# EAGLE schematic Smoothiepanel (EAGLE 6.3)
Assembly variants: NOSCREEN
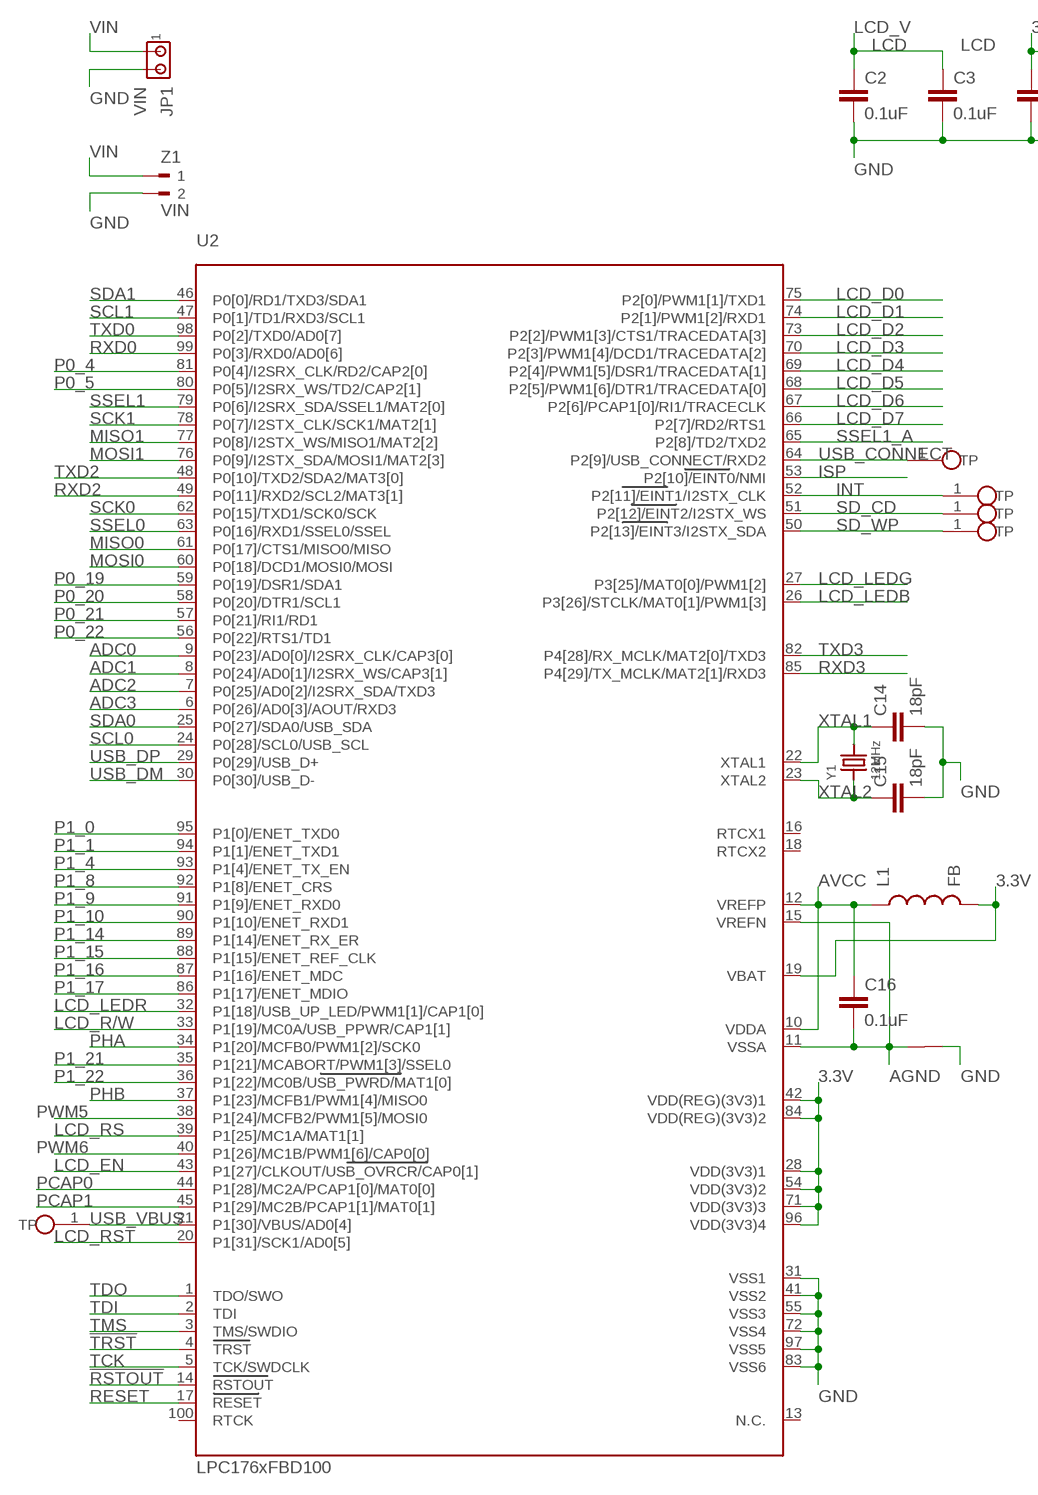
[diagram p0: schematic, sheet 1, part 1 of 2]
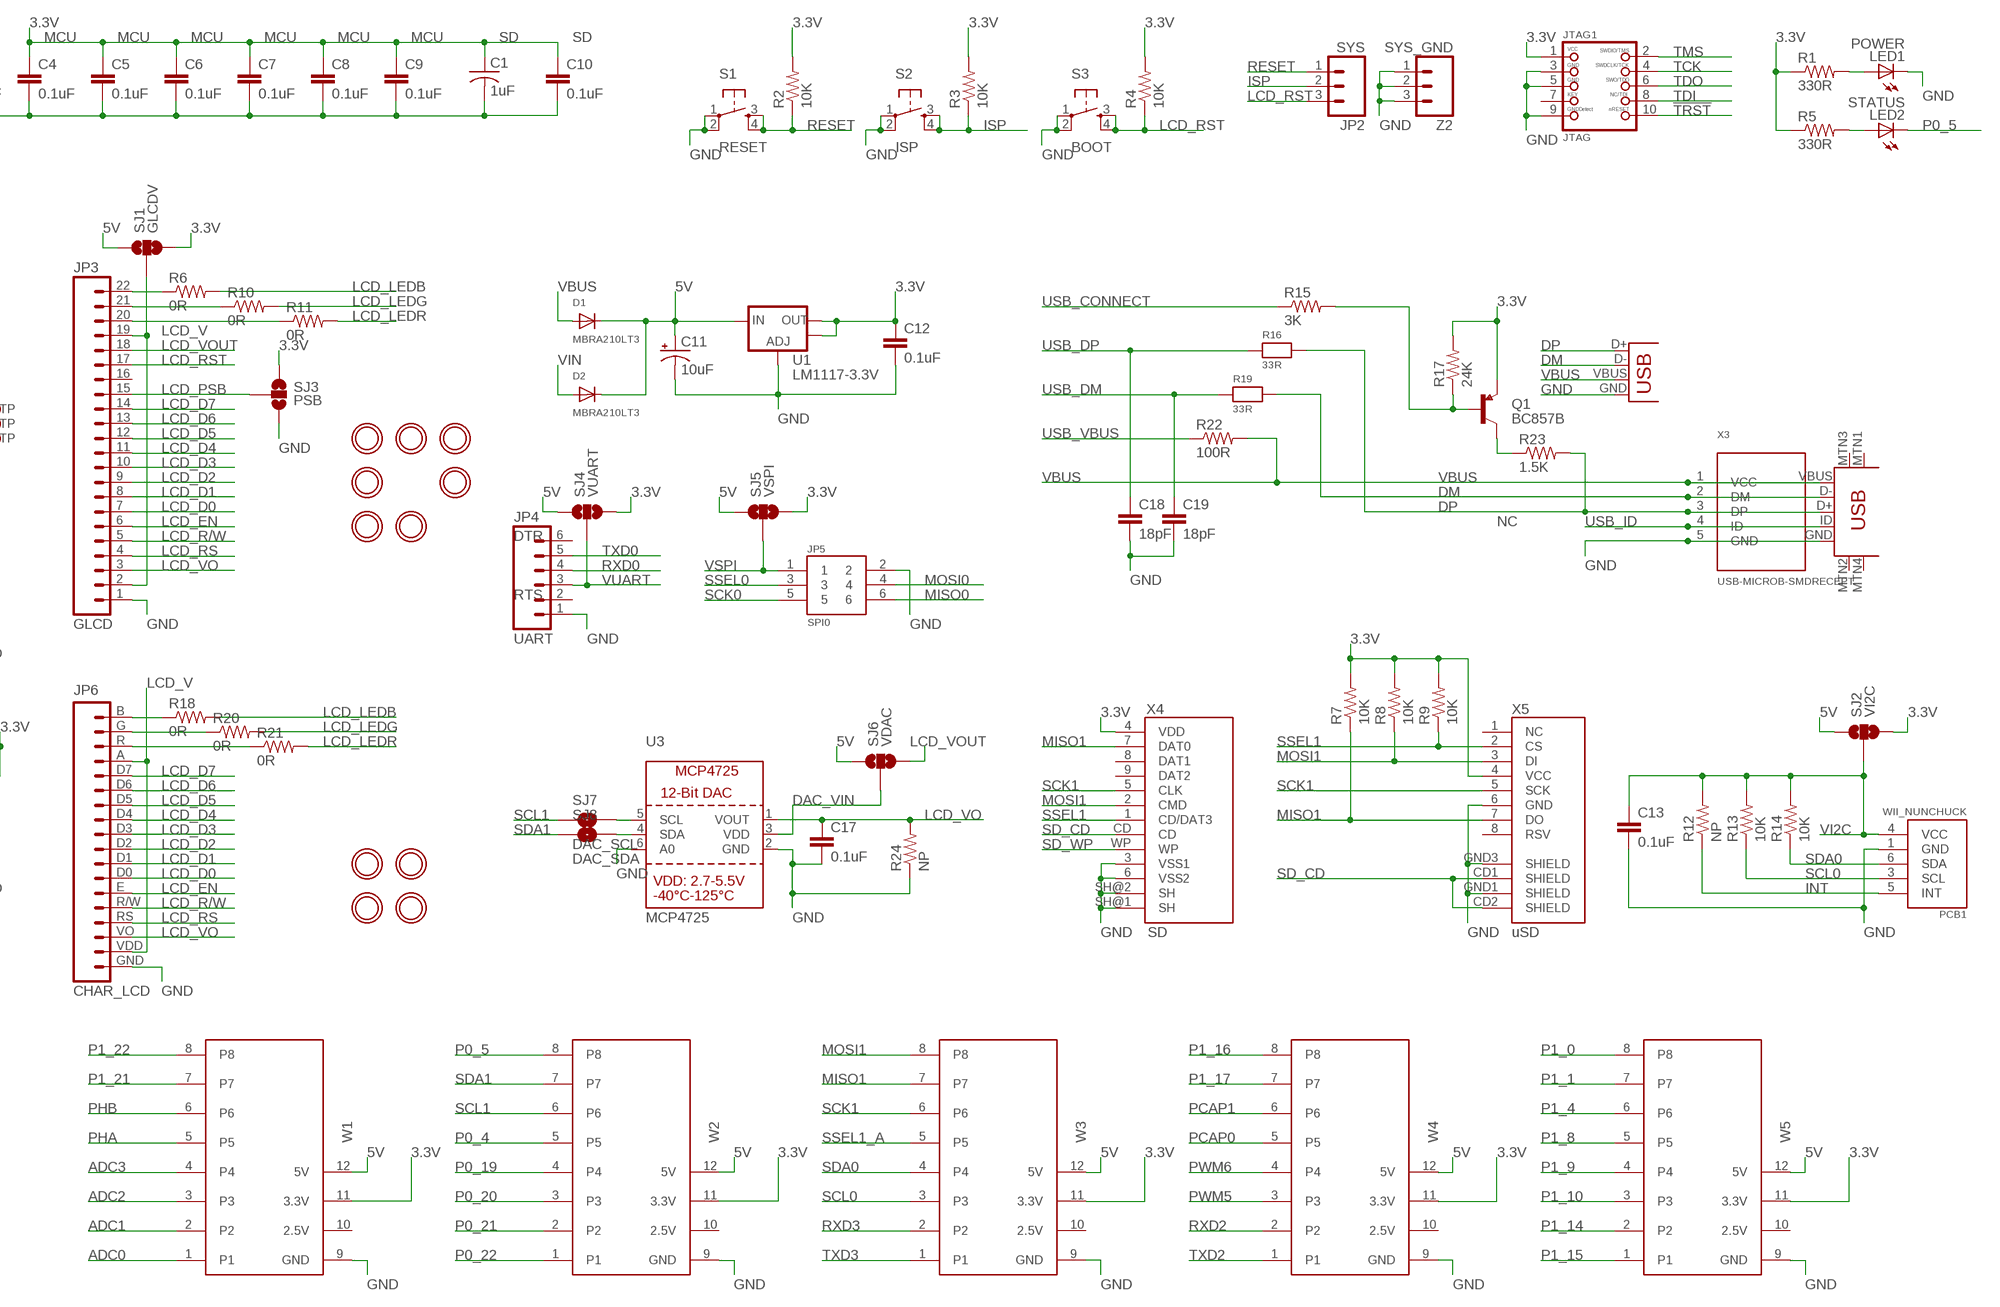
[diagram p1: schematic, sheet 1, part 2 of 2]

## Parts
C1  1uF  C-USC0805  [C0805]
C2  0.1uF  CAP0603-CAP  [0603-CAP]
C3  0.1uF  CAP0603-CAP  [0603-CAP]
C4  0.1uF  CAP0603-CAP  [0603-CAP]
C5  0.1uF  CAP0603-CAP  [0603-CAP]
C6  0.1uF  CAP0603-CAP  [0603-CAP]
C7  0.1uF  CAP0603-CAP  [0603-CAP]
C8  0.1uF  CAP0603-CAP  [0603-CAP]
C9  0.1uF  CAP0603-CAP  [0603-CAP]
C10  0.1uF  CAP0603-CAP  [0603-CAP]
C11  10uF  CAP_POL1206  [EIA3216]
C12  0.1uF  CAP0603-CAP  [0603-CAP]
C13  0.1uF  CAP0603-CAP  [0603-CAP]
C14  18pF  CAP0603-CAP  [0603-CAP]
C15  18pF  CAP0603-CAP  [0603-CAP]
C16  0.1uF  CAP0603-CAP  [0603-CAP]
C17  0.1uF  CAP0603-CAP  [0603-CAP]
C18  18pF  CAP0603-CAP  [0603-CAP]
C19  18pF  CAP0603-CAP  [0603-CAP]
D1  MBRA210LT3  DIODESMA  [SMADIODE]
D2  MBRA210LT3  DIODESMA  [SMADIODE]
JP1  VIN  MTA02-100  [10X02MTA]
JP2  SYS  M03PTH  [1X03]
JP3  GLCD  M22  [1X22]
JP4  UART  M06SIP  [1X06]
JP5  SPI0  M03X2  [2X3-SHROUDED]
JP6  CHAR_LCD  LCD_TEXT  [TEXT_LCD]
JTAG1  JTAG  JTAG-CORTEXM3  [2X05_1.27MM_SMT]
L1  FB  INDUCTOR0603  [0603]
LED1  POWER  LED0603  [LED-0603]
LED2  STATUS  LED0603  [LED-0603]
MH1  MOUNTINGHOLE2.5_THICK  [MOUNTINGHOLE_2.5_PLATED_THICK]
MH2  MOUNTINGHOLE2.5_THICK  [MOUNTINGHOLE_2.5_PLATED_THICK]
MH3  MOUNTINGHOLE2.5_THICK  [MOUNTINGHOLE_2.5_PLATED_THICK]
MH4  MOUNTINGHOLE2.5_THICK  [MOUNTINGHOLE_2.5_PLATED_THICK]
MH5  MOUNTINGHOLE2.5_THICK  [MOUNTINGHOLE_2.5_PLATED_THICK]
MH6  MOUNTINGHOLE2.5_THICK  [MOUNTINGHOLE_2.5_PLATED_THICK]
MH7  MOUNTINGHOLE2.5_THICK  [MOUNTINGHOLE_2.5_PLATED_THICK]
MH8  MOUNTINGHOLE3.0THIN  [MOUNTINGHOLE_3.0_PLATEDTHIN]
MH9  MOUNTINGHOLE3.0THIN  [MOUNTINGHOLE_3.0_PLATEDTHIN]
MH10  MOUNTINGHOLE3.0THIN  [MOUNTINGHOLE_3.0_PLATEDTHIN]
MH11  MOUNTINGHOLE3.0THIN  [MOUNTINGHOLE_3.0_PLATEDTHIN]
N1  NET_LINK  [NET_LINK]
PCB1  WII_NUNCHUCK  [WII_NUNCHUCK]
Q1  BC857B  TRANSISTOR_PNPSMD  [SOT23-3]
R1  330R  RESISTOR0603-RES  [0603-RES]
R2  10K  RESISTOR0603-RES  [0603-RES]
R3  10K  RESISTOR0603-RES  [0603-RES]
R4  10K  RESISTOR0603-RES  [0603-RES]
R5  330R  RESISTOR0603-RES  [0603-RES]
R6  0R  RESISTOR0603-RES  [0603-RES]
R7  10K  RESISTOR0603-RES  [0603-RES]
R8  10K  RESISTOR0603-RES  [0603-RES]
R9  10K  RESISTOR0603-RES  [0603-RES]
R10  0R  RESISTOR0603-RES  [0603-RES]
R11  0R  RESISTOR0603-RES  [0603-RES]
R12  NP  RESISTOR0603-RES  [0603-RES]
R13  10K  RESISTOR0603-RES  [0603-RES]
R14  10K  RESISTOR0603-RES  [0603-RES]
R15  3K  RESISTOR0603-RES  [0603-RES]
R16  33R  RESISTOR_0603MP  [_0603MP]
R17  24K  RESISTOR0603-RES  [0603-RES]
R18  0R  RESISTOR0603-RES  [0603-RES]
R19  33R  RESISTOR_0603MP  [_0603MP]
R20  0R  RESISTOR0603-RES  [0603-RES]
R21  0R  RESISTOR0603-RES  [0603-RES]
R22  100R  RESISTOR0603-RES  [0603-RES]
R23  1.5K  RESISTOR0603-RES  [0603-RES]
R24  NP  RESISTOR0603-RES  [0603-RES]
S1  RESET  TAC_SWITCHSMD  [TACTILE_SWITCH_SMD]
S2  ISP  TAC_SWITCHSMD  [TACTILE_SWITCH_SMD]
S3  BOOT  TAC_SWITCHSMD  [TACTILE_SWITCH_SMD]
SJ1  GLCDV  SOLDERJUMPER_2WAYS  [SJ_3]
SJ2  VI2C  SOLDERJUMPER_2WAYS  [SJ_3]
SJ3  PSB  SOLDERJUMPER_2WAYS  [SJ_3]
SJ4  VUART  SOLDERJUMPER_2WAYS  [SJ_3]
SJ5  VSPI  SOLDERJUMPER_2WAYS  [SJ_3]
SJ6  VDAC  SOLDERJUMPER_2WAYS  [SJ_3]
SJ7  DAC_SCL  SOLDERJUMPERTRACE  [SJ_2S-TRACE]
SJ8  DAC_SDA  SOLDERJUMPERTRACE  [SJ_2S-TRACE]
TP1  TPAD1.5  [TPAD-1.5]
TP3  TPAD1.5  [TPAD-1.5]
TP4  TPAD1.5  [TPAD-1.5]
TP5  TPAD1.5  [TPAD-1.5]
TP6  TPAD1.5  [TPAD-1.5]
U1  LM1117-3.3V  V_REG_LM1117SOT223  [SOT223]
U2  LPC176xFBD100  LPC1768  [LQFP100]
U3  MCP4725  DAC_MCP4725  [SOT23-6]
W1  WING1  PAPILIO-WING-8BITSF  [PAPILIO-WING-8BITS-F]
W2  WING2  PAPILIO-WING-8BITSF  [PAPILIO-WING-8BITS-F]
W3  WING3  PAPILIO-WING-8BITSF  [PAPILIO-WING-8BITS-F]
W4  WING4  PAPILIO-WING-8BITSF  [PAPILIO-WING-8BITS-F]
W5  WING5  PAPILIO-WING-8BITSF  [PAPILIO-WING-8BITS-F]
X1  USB-B  USBPTH  [USB-B-PTH]
X2  mUSB  USB-MINIB-5PIN  [USB-MINIB]  (not fitted in variant NOSCREEN)
X3  USB-MICROB-SMDRECEPT  [USB-MICROB-RECEPT]  (not fitted in variant NOSCREEN)
X4  SD  SD_CARD_SOCKET4UCON  [SDCARD_4UCONN]
X5  uSD  USD-SOCKETNEW  [MICRO-SD-SOCKET-PP]  (not fitted in variant NOSCREEN)
Y1  12MHz  CRYSTALTHIN  [CRYSTAL_3.2X2.5]
Z1  VIN  180-2  [180-2]
Z2  SYS_GND  M03PTH  [1X03]

## Nets
3.3V: C1.1 C4.1 C5.1 C6.1 C7.1 C8.1 C9.1 C10.1 C12.1 JTAG1.1 L1.2 Q1.2(E) R1.1 R2.2 R3.2 R4.2 R5.1 R7.2 R8.2 R9.2 R17.2 SJ1.3 SJ2.3 SJ3.1 SJ4.3 SJ5.3 U1.2(OUT) U1.4(OUT) U2.19(VBAT) U2.28(VDD(3V3)1) U2.42(VDD(REG)(3V3)1) U2.54(VDD(3V3)2) U2.71(VDD(3V3)3) U2.84(VDD(REG)(3V3)2) U2.96(VDD(3V3)4) W1.11(3.3V) W2.11(3.3V) W3.11(3.3V) W4.11(3.3V) W5.11(3.3V) X4.4(VDD) X5.4(VCC)
5V: C11.A(+) D1.C D2.C SJ1.1 SJ2.1 SJ4.1 SJ5.1 SJ6.1 U1.3(IN) W1.12(5V) W2.12(5V) W3.12(5V) W4.12(5V) W5.12(5V)
!RSTOUT!: U2.14(RSTOUT)
!TRST!: JTAG1.10 U2.4(TRST)
ADC0: U2.9(P0[23]/AD0[0]/I2SRX_CLK/CAP3[0]) W1.1
ADC1: U2.8(P0[24]/AD0[1]/I2SRX_WS/CAP3[1]) W1.2
ADC2: U2.7(P0[25]/AD0[2]/I2SRX_SDA/TXD3) W1.3
ADC3: U2.6(P0[26]/AD0[3]/AOUT/RXD3) W1.4
AGND: C16.2 N1.P$1 U2.11(VSSA) U2.15(VREFN)
AVCC: C16.1 L1.1 U2.10(VDDA) U2.12(VREFP)
DAC_SCL_RES: SJ7.2 U3.5(SCL)
DAC_SDA_RES: SJ8.2 U3.4(SDA)
DAC_VIN: SJ6.2 U3.3(VDD)
DM: R19.2 X1.D- X2.D- X3.2(DM)
DP: R16.2 R23.2 X1.D+ X2.D+ X3.3(DP)
GND: C1.2 C2.2 C3.2 C4.2 C5.2 C6.2 C7.2 C8.2 C9.2 C10.2 C11.C(-) C12.2 C13.2 C14.2 C15.2 C17.2 C18.2 C19.2 JP1.2 JP3.1 JP4.1 JP5.2 JP6.GND JTAG1.3 JTAG1.5 JTAG1.9 LED1.C N1.P$2 PCB1.1(GND) R24.1 S1.1 S1.2 S2.1 S2.2 S3.1 S3.2 SJ3.3 U1.1(ADJ) U2.31(VSS1) U2.41(VSS2) U2.55(VSS3) U2.72(VSS4) U2.83(VSS6) U2.97(VSS5) U3.2(GND) U3.6(A0) W1.9(GND) W2.9(GND) W3.9(GND) W4.9(GND) W5.9(GND) X1.GND X2.GND X3.5(GND) X4.3(VSS1) X4.6(VSS2) X4.SH@1(SH) X4.SH@2(SH) X5.6(GND) X5.GND1(SHIELD) X5.GND3(SHIELD) Z1.2 Z2.1 Z2.2 Z2.3
INT: PCB1.5(INT) R12.1 TP4.1(TP) U2.52(P2[11]/EINT1/I2STX_CLK)
ISP: JP2.2 R3.1 S2.3 S2.4 U2.53(P2[10]/EINT0/NMI)
LCD_D0: JP3.7 JP6.D0 U2.75(P2[0]/PWM1[1]/TXD1)
LCD_D1: JP3.8 JP6.D1 U2.74(P2[1]/PWM1[2]/RXD1)
LCD_D2: JP3.9 JP6.D2 U2.73(P2[2]/PWM1[3]/CTS1/TRACEDATA[3])
LCD_D3: JP3.10 JP6.D3 U2.70(P2[3]/PWM1[4]/DCD1/TRACEDATA[2])
LCD_D4: JP3.11 JP6.D4 U2.69(P2[4]/PWM1[5]/DSR1/TRACEDATA[1])
LCD_D5: JP3.12 JP6.D5 U2.68(P2[5]/PWM1[6]/DTR1/TRACEDATA[0])
LCD_D6: JP3.13 JP6.D6 U2.67(P2[6]/PCAP1[0]/RI1/TRACECLK)
LCD_D7: JP3.14 JP6.D7 U2.66(P2[7]/RD2/RTS1)
LCD_EN: JP3.6 JP6.E U2.43(P1[27]/CLKOUT/USB_OVRCR/CAP0[1])
LCD_LEDB: R6.2 R18.2 U2.26(P3[26]/STCLK/MAT0[1]/PWM1[3])
LCD_LEDB_RES: JP3.22 R6.1
LCD_LEDB_RES1: JP6.B R18.1
LCD_LEDG: R10.2 R20.2 U2.27(P3[25]/MAT0[0]/PWM1[2])
LCD_LEDG_RES: JP3.21 R10.1
LCD_LEDG_RES1: JP6.G R20.1
LCD_LEDR: R11.2 R21.2 U2.32(P1[18]/USB_UP_LED/PWM1[1]/CAP1[0])
LCD_LEDR_RES: JP3.20 R11.1
LCD_LEDR_RES1: JP6.R R21.1
LCD_PSB: JP3.15 SJ3.2
LCD_R/W: JP3.5 JP6.R/W U2.33(P1[19]/MC0A/USB_PPWR/CAP1[1])
LCD_RS: JP3.4 JP6.RS U2.39(P1[25]/MC1A/MAT1[1])
LCD_RST: JP2.3 JP3.17 R4.1 S3.3 S3.4 U2.20(P1[31]/SCK1/AD0[5])
LCD_V: C2.1 C3.1 JP3.2 JP3.19 JP6.A JP6.VDD SJ1.2
LCD_VO: C17.1 JP3.3 JP6.VO R24.2 U3.1(VOUT)
LCD_VOUT: JP3.18 SJ6.3
LED1_R: LED1.A R1.2
LED2_R: LED2.A R5.2
MISO0: JP5.6 U2.61(P0[17]/CTS1/MISO0/MISO)
MISO1: R7.1 U2.77(P0[8]/I2STX_WS/MISO1/MAT2[2]) W3.7 X4.7(DAT0) X5.7(DO)
MOSI0: JP5.4 U2.60(P0[18]/DCD1/MOSI0/MOSI)
MOSI1: R8.1 U2.76(P0[9]/I2STX_SDA/MOSI1/MAT2[3]) W3.8 X4.2(CMD) X5.3(DI)
P0_4: U2.81(P0[4]/I2SRX_CLK/RD2/CAP2[0]) W2.5
P0_5: LED2.C U2.80(P0[5]/I2SRX_WS/TD2/CAP2[1]) W2.8
P0_19: U2.59(P0[19]/DSR1/SDA1) W2.4
P0_20: U2.58(P0[20]/DTR1/SCL1) W2.3
P0_21: U2.57(P0[21]/RI1/RD1) W2.2
P0_22: U2.56(P0[22]/RTS1/TD1) W2.1
P1_0: U2.95(P1[0]/ENET_TXD0) W5.8
P1_1: U2.94(P1[1]/ENET_TXD1) W5.7
P1_4: U2.93(P1[4]/ENET_TX_EN) W5.6
P1_8: U2.92(P1[8]/ENET_CRS) W5.5
P1_9: U2.91(P1[9]/ENET_RXD0) W5.4
P1_10: U2.90(P1[10]/ENET_RXD1) W5.3
P1_14: U2.89(P1[14]/ENET_RX_ER) W5.2
P1_15: U2.88(P1[15]/ENET_REF_CLK) W5.1
P1_16: U2.87(P1[16]/ENET_MDC) W4.8
P1_17: U2.86(P1[17]/ENET_MDIO) W4.7
P1_21: U2.35(P1[21]/MCABORT/PWM1[3]/SSEL0) W1.7
P1_22: U2.36(P1[22]/MC0B/USB_PWRD/MAT1[0]) W1.8
PCAP0: U2.44(P1[28]/MC2A/PCAP1[0]/MAT0[0]) W4.5
PCAP1: U2.45(P1[29]/MC2B/PCAP1[1]/MAT0[1]) W4.6
PHA: U2.34(P1[20]/MCFB0/PWM1[2]/SCK0) W1.5
PHB: U2.37(P1[23]/MCFB1/PWM1[4]/MISO0) W1.6
PWM5: U2.38(P1[24]/MCFB2/PWM1[5]/MOSI0) W4.3
PWM6: U2.40(P1[26]/MC1B/PWM1[6]/CAP0[0]) W4.4
RESET: JP2.1 R2.1 S1.3 S1.4 U2.17(RESET)
RXD0: JP4.4 U2.99(P0[3]/RXD0/AD0[6])
RXD2: U2.49(P0[11]/RXD2/SCL2/MAT3[1]) W4.2
RXD3: U2.85(P4[29]/TX_MCLK/MAT2[1]/RXD3) W3.2
SCK0: JP5.5 U2.62(P0[15]/TXD1/SCK0/SCK)
SCK1: U2.78(P0[7]/I2STX_CLK/SCK1/MAT2[1]) W3.6 X4.5(CLK) X5.5(SCK)
SCL0: PCB1.3(SCL) R13.1 U2.24(P0[28]/SCL0/USB_SCL) W3.3
SCL1: SJ7.1 U2.47(P0[1]/TD1/RXD3/SCL1) W2.6
SD_CD: TP5.1(TP) U2.51(P2[12]/EINT2/I2STX_WS) X4.CD X5.CD1(SHIELD) X5.CD2(SHIELD)
SD_WP: TP6.1(TP) U2.50(P2[13]/EINT3/I2STX_SDA) X4.WP
SDA0: PCB1.6(SDA) R14.1 U2.25(P0[27]/SDA0/USB_SDA) W3.4
SDA1: SJ8.1 U2.46(P0[0]/RD1/TXD3/SDA1) W2.7
SSEL0: JP5.3 U2.63(P0[16]/RXD1/SSEL0/SSEL)
SSEL1: R9.1 U2.79(P0[6]/I2SRX_SDA/SSEL1/MAT2[0]) X4.1(CD/DAT3) X5.2(CS)
SSEL1_A: U2.65(P2[8]/TD2/TXD2) W3.5
TCK: JTAG1.4 U2.5(TCK/SWDCLK)
TDI: JTAG1.8 U2.2(TDI)
TDO: JTAG1.6 U2.1(TDO/SWO)
TMS: JTAG1.2 U2.3(TMS/SWDIO)
TXD0: JP4.5 U2.98(P0[2]/TXD0/AD0[7])
TXD2: U2.48(P0[10]/TXD2/SDA2/MAT3[0]) W4.1
TXD3: U2.82(P4[28]/RX_MCLK/MAT2[0]/TXD3) W3.1
USB_CONNECT: R15.1 TP3.1(TP) U2.64(P2[9]/USB_CONNECT/RXD2)
USB_CONNECT_BASE: Q1.1(B) R15.2 R17.1
USB_CONNECT_COLLECTOR: Q1.3(C) R23.1
USB_DM: C19.1 R19.1 U2.30(P0[30]/USB_D-)
USB_DP: C18.1 R16.1 U2.29(P0[29]/USB_D+)
USB_ID: X2.ID X3.4(ID)
USB_VBUS: R22.1 TP1.1(TP) U2.21(P1[30]/VBUS/AD0[4])
VBUS: D1.A R22.2 X1.VBUS X2.VBUS X3.1(VCC)
VI2C: C13.1 PCB1.4(VCC) R12.2 R13.2 R14.2 SJ2.2
VIN: D2.A JP1.1 Z1.1
VSPI: JP5.1 SJ5.2
VUART: JP4.3 SJ4.2
XTAL1: C14.1 U2.22(XTAL1) Y1.2
XTAL2: C15.1 U2.23(XTAL2) Y1.1
Unconnected: JP3.16 JP4.2 JP4.6 JTAG1.7 U2.13(N.C.) U2.16(RTCX1) U2.18(RTCX2) U2.100(RTCK) W1.10(2.5V) W2.10(2.5V) W3.10(2.5V) W4.10(2.5V) W5.10(2.5V) X2.MTN1(MTN2) X2.MTN2(MTN3) X2.MTN3(MTN1) X2.MTN4 X4.8(DAT1) X4.9(DAT2) X5.1(NC) X5.8(RSV)

## Notes on the sheet
- LCD | LCD | MCU | MCU | MCU | MCU | MCU | MCU | SD | SD
- NC
- DTR
- RTS

## Library data of the parts
C1 = resistor:C-US: CAPACITOR, American symbol
C2-C10 C12 C13 C16-C19 = SparkFun-Capacitors:CAP: Capacitor Standard 0603 ceramic capacitor, and 0.1" leaded capacitor.
C11 = SparkFun:CAP_POL: Capacitor Polarized These are standard SMD and PTH capacitors. Normally 10uF, 47uF, and 100uF in electrolytic and tantalum varieties. Always verify the external diameter of the through hole cap, it varies with capacity, voltage, and manufacturer. The EIA devices should be standard.
C14 C15 = SparkFun-Passives:CAP: Capacitor Standard 0603 ceramic capacitor, and 0.1" leaded capacitor.
D1 D2 = microbuilder:DIODE: Diode SMADIODE - SMA Surface Mount Package 20V 1A Schottky Diode Digikey (500mV @ 1A, 500uA Vr @ 20V): 641-1014-6-ND 10V 2A Schottky Diode Digikey (350mV @ 2A, 700uA Vr @ 10V): MBRA210LT3 SOD-123 30V 200mA (800mV Vf, 2uA Vr @ 25V) Schottky Diode (very fast switching for boost, etc.) - Digikey: BAT54T1GOSTR-ND 30V 500mA (430mV Vf, 130uA Vr @ 30V) Schottky Diode - Digikey: B0530W-FDICT-ND MBR120 1A 20V (0.34Vf) Schottky Diode - Digikey: MBR120VLSFT1GOSCT-ND SOD-323 10V 570mA (380mV Vf, 3ns) Schottky Diode - Digikey: ZLLS410CT-ND 1N4148WS - 75V 150mA (1V Vf @ 10mA, 4ns) Simple Diode - Digikey: 1N4148WSFSCT-ND, Mouser: 512-1N4148WS SOD-523 BAT54 30V 200mA Schottky (0.8 Vf @ 100mA, 5ns) - Digikey: BAT54XV2CT-ND 30V 30mA Schottky Diode (RB751S-40TE61) - Digikey: RB751S-40TE61CT-ND SOT23-R/W - SOT23 Package (R = Solder Paste/Reflow Ovens, W = Hand-Soldering) BAT54Film 40V 300mA - Digikey: 497-7162-1-ND DO-1N4148 Through Hole Small Current Diode (any model)
JP1 = con-amp:MTA02-100: AMP connector
JP2 Z2 = logxen:M03: Header 3 Standard 3-pin 0.1" header. Use with straight break away headers (SKU : PRT-00116), right angle break away headers (PRT-00553), swiss pins (PRT-00743), machine pins (PRT-00117), and female headers (PRT-00115). Molex polarized connector foot print use with SKU : PRT-08232 with associated crimp pins and housings.
JP3 = logxen:M22
JP4 = logxen:M06: Header 6 Standard 6-pin 0.1" header. Use with straight break away headers (SKU : PRT-00116), right angle break away headers (PRT-00553), swiss pins (PRT-00743), machine pins (PRT-00117), and female headers (PRT-00115). Molex polarized connector foot print use with SKU : PRT-08094 with associated crimp pins and housings. NOTES ON THE VARIANTS LOCK and LOCK_LONGPADS... This footprint was designed to help hold the alignment of a through-hole component (i.e. 6-pin header) while soldering it into place. You may notice that each hole has been shifted either up or down by 0.005 of an inch from it's more standard position (which is a perfectly straight line). This slight alteration caused the pins (the squares in the middle) to touch the edges of the holes. Because they are alternating, it causes a "brace" to hold the component in place. 0.005 has proven to be the perfect amount of "off-center" position when using our standard breakaway headers. Although looks a little odd when you look at the bare footprint, once you have a header in there, the alteration is very hard to notice. Also, if you push a header all the way into place, it is covered up entirely on the bottom side. This idea of altering the position of holes to aid alignment will be further integrated into the Sparkfun Library for other footprints. It can help hold any component with 3 or more connection pins.
JP5 = logxen:M03X2: Shrouded 2x3 .1" header, with keying.
JP6 = logxen:LCD_TEXT
JTAG1 = microbuilder:JTAG-CORTEXM3: Serial Wire (SW-DP) Connector This standard 0.05" 10-pin connector is for use with the Cortex M0/M3's native SWD (serial wire debugger) interface (SW-DP). Some boards support a 20-pin combined JTAG+SWD connector (SWJ-DP), such as the LPC1700 family, but many smaller devices only work with SWD which typically use the smaller 10-pin SW-DP connecter (the LPC1300 family, for example, only supports SWD). 2x05 1.27mm/0.05" Connector: This is the standard SMT connector defined by ARM for all Cortex devices, and should be used in most situations and for forward-compatibility since any new devices coming to market will likely use this connector. MOLEX 10 Pin 0.1" Connector: This 0.1" 10 pin connector has the same pin layout as the standard 0.05" connector, but is easier to work with if you are using standard jumper wires or custom cables to connect your SWD hardware. MOLEX 20 Pin 0.1" Connector: This 0.1" 20 pin connector is the same model used for ARM7/ARM9 JTAG debuggers, but is connected to match the pins on the Segger J-Link for ARM (which supports both JTAG and SWD debugging). See the following document from ARM for more information on Cortex M3 Debug Connectors: http://infocenter.arm.com/help/topic/com.arm.doc.faqs/attached/13634/cortex_debug_connectors.pdf And the following page for an overview with images of the different connector types: http://www.keil.com/peripherals/coresight/connectors.asp
L1 = SparkFun-Passives:INDUCTOR: Inductors Basic Inductor/Choke - 0603 and 1206. Footprints are not proven and vary greatly between part numbers.
LED1 LED2 = SparkFun-LED:LED: LEDs Standard schematic elements and footprints for 5mm, 3mm, 1206, and 0603 sized LEDs. 5mm - Spark Fun Electronics SKU : COM-00529 (and others)
MH1-MH11 = microbuilder:MOUNTINGHOLE: Mounting Hole For #2 screws (0.086"/2.18mm width, 0.094"/2.4mm hole) use 2.5mm
N1 = logxen:NET_LINK
PCB1 = logxen:WII_NUNCHUCK
Q1 = SparkFun-DiscreteSemi:TRANSISTOR_PNP: Generic PNP BJT. Double check pinouts against datasheets- not all devices are the same!
R1-R11 R13-R15 R17 R22-R24 = SparkFun-Resistors:RESISTOR: Resistor Basic schematic elements and footprints for 0603, 1206, and PTH resistors.
R12 R18 R20 R21 = SparkFun-Passives:RESISTOR: Resistor Basic schematic elements and footprints for 0603, 1206, and PTH resistors.
R16 R19 = microbuilder:RESISTOR: Resistors 0402 - 0402 Surface Mount Package 22 Ohm 1% 1/16W [Digikey: 311-22.0LRTR-ND] 33 Ohm 5% 1/16W 1.0K 5% 1/16W 1.5K 5% 1/16W 2.0K 1% 1/16W 10.0K 1% 1/16W [Digikey: 311-10.0KLRTR-ND] 10.0K 5% 1/16W [Digikey: RMCF0402JT10K0TR-ND] 12.1K 1% 1/16W [Digikey: 311-22.0LRTR-ND] 100.0K 5% 1/16W 0603 - 0603 Surface Mount Package 0 Ohm 1/10 Watt 1% Resistor 15 Ohm 1/10 Watt 1% Resistor 33 Ohm 1/10 Watt 1% Resistor 49.9 Ohm 1/10 Watt 1% Resistor 100 Ohm 1/10 Watt 1% Resistor 150 Ohm 1/10 Watt 1% Resistor 240 Ohm 1/10 Watt 1% Resistor 390 Ohm 1/10 Watt 1% Resistor 560 Ohm 1/10 Watt 1% Resistor 680 Ohm 1/10 Watt 1% Resistor 750 Ohm 1/10 Watt 1% Resistor 1.0K Ohm 1/10 Watt 1% Resistor 1.5K Ohm 1/10 Watt 1% Resistor 2.0K Ohm 1/10 Watt 1% Resistor 2.2K Ohm 1/10 Watt 1% Resistor 3.3K Ohm 1/10 Watt 1% Resistor 4.7K Ohm 1/10 Watt 1% Resistor 10.0K Ohm 1/10 Watt 1% Resistor 12.0K Ohm 1/10 Watt 1% Resistor 12.1K Ohm 1/10 Watt 1% Resistor 20.0K Ohm 1/10 Watt 1% Resistor 33.0K Ohm 1/10 Watt 1% Resistor 100.0K Ohm 1/10 Watt 1% Resistor 0805 - 0805 Surface Mount Package 0 Ohm 1/8 Watt 1% Resistor 33 Ohm 1/8 Watt 1% Resistor 100 Ohm 1/8 Watt 1% Resistor 150 Ohm 1/8 Watt 1% Resistor 200 Ohm 1/8 Watt 1% Resistor 240 Ohm 1/8 Watt 1% Resistor 330 Ohm 1/8 Watt 1% Resistor 390 Ohm 1/8 Watt 1% Resistor 470 Ohm 1/8 Watt 1% Resistor 1.0K Ohm 1/8 Watt 1% Resistor 1.5K Ohm 1/8 Watt 1% Resistor 2.0K Ohm 1/8 Watt 1% Resistor 4.7K Ohm 1/8 Watt 1% Resistor 5.1K Ohm 1/8 Watt 1% Resistor 5.6K Ohm 1/8 Watt 1% Resistor 10.0K Ohm 1/8 Watt 1% Resistor 22.0K Ohm 1/8 Watt 1% Resistor 33.0K Ohm 1/8 Watt 1% Resistor 100K Ohm 1/8 Watt 1% Resistor 1206 - 1206 Surface Mount Package 2012 - 2010 Surface Mount Package 0.11 Ohm 1/2 Watt 1% Resistor - Digikey: RHM.11UCT-ND
S1-S3 = SparkFun-Electromechanical:TAC_SWITCH: Momentary Switch Button commonly used for reset or general input. Spark Fun Electronics SKU : COM-00097
SJ1 SJ3-SJ6 = SparkFun:SOLDERJUMPER_2WAY: Solder Jumper 2 way solder jumper
SJ2 = SparkFun-Passives:SOLDERJUMPER_2WAY: Solder Jumper 2 way solder jumper
SJ7 SJ8 = SparkFun-Passives:SOLDERJUMPER: Solder Jumper Standard SMD solder jumper. Used to automate production. Two varients : Normally Open and Normally Closed are the same, but have different paste layers. NC will have a large amount of paste and should jumper during reflow.
TP1 TP3-TP6 = logxen:TPAD
U1 = SparkFun:V_REG_LM1117: Voltage Regulator LM1117 Standard adjustable voltage regulator but in SMD form. Spark Fun Electronics SKU : COM-00595
U2 = microbuilder:LPC1768: LPC1768 100 MHz 32-bit ARM Cortex-M3 based microcontroller featuring a high level of integration and low power consumption. 512 kB Flash, 64 kB SRAM, USB Device/Host/OTG, Ethernet, CAN, I2S, 10-bit DAC Digikey: 568-4796-ND
U3 = microbuilder:DAC_MCP4725: MCP4725 - 12-Bit I2C DAC with on-board EEPROM Settling Time: 6 µs 2.7-5.5V Supply 100kHz, 400kHz, 3.4 Mbps I²C EEPROM can be used to store a specific output voltage which will be set coming out of reset I²C Address: 1100 A2 A1 A0 A0 is set via the A0 pin, A2 and A1 are hard-wired on the chip depending on the model chosen: Part Number A2 A1 Code MCP4725A0T-E/CH 0 0 AJNN MCP4725A1T-E/CH 0 1 APNN MCP4725A2T-E/CH 1 0 AQNN MCP4725A3T-E/CH 1 1 ARNN
W1-W5 = logxen:PAPILIO-WING-8BITS
X1 = SparkFun-Connectors:USB: USB Connectors USB-B-PTH is fully proven SKU : PRT-00139/CONN-08278 USB-miniB is fully proven SKU : PRT-00587 USB-A-PCB is untested. USB-A-H is throughly reviewed, but untested. Spark Fun Electronics SKU : PRT-00437 USB-B-SMT is throughly reviewed, but untested. Needs silkscreen touching up. USB-A-S has not been used/tested USB-MB-H has not been used/tested USB-MICROB has been used. CONN-09505; PROD_ID: CONN-08278
X2 = SparkFun-Connectors:USB-MINIB: Mini-USB "B" connector with 5th pin broken out. Created new symbol breaking out 5th "ID" pin in mini/micro USB connector spec. See: http://en.wikipedia.org/wiki/Mini_usb#Cables. Uses same footprint as 4-pin symbol. Also added pins to connect to mounting / shield pads if required (probably not generally needed as signals aren't shielded once they leave the connector).
X3 = logxen:USB-MICROB-SMDRECEPT
X4 = SparkFun-Connectors:SD_CARD_SOCKET: SD Memory Card Connector, push-push normal type, CD enable, WP enable
X5 = SparkFun-Connectors:USD-SOCKET: microSD Socket Push-push type uSD socket. Schematic element and footprint production proven. Spark Fun Electronics SKU : PRT-00127. tDoc lines correctly indicate media card edge positions when inserting (unlocked, locked, depressed).
Y1 = microbuilder:CRYSTAL: Crystals HC49UP - Surface Mount Crystal 4.0MHz 18pF +/-30ppm Surface Mount Crystal [Digikey: 535-9857-1-ND] 12.0 MHz Surface Mount Crystal [Digikey: 535-9869-6-ND] 25.0 MHz Surface Mount Crystal [Digikey: 535-9078-1-ND] 2.5 x 2.0mm - MEMs SMT Crystal 16.0 MHz 10pF 20ppm 2.5 x 2.0mm Crystal [Digikey -40-85°C: 535-10923-1-ND] 3.2 x 2.5mm - MEMs SMT Crystal 12.0 MHz 8pF 15ppm 3.2 x 2.5mm Crystal [Digikey: -10-70°C: 644-1047-1-ND -40-125°C: 644-1128-1-ND] 16.0 MHz 8pF 15ppm 3.2 x 2.5mm Crystal [Digikey: -10-70°C: 644-1049-1-ND -40-125°C: 644-1129-2-ND] 16.0 MHz 10pF 10ppm 3.2 x 2.5mm Crystal [Digikey: 644-1100-1-ND] 27.12 MHz 18pF 30ppm 3.2 x 2.5mm Crystal [Digikey: 887-1424-1-ND] 27.12MHz 10pF 10ppm 3.2 x 2.5mm Crystal [Digikey: 887-1329-1-ND] 4.9 x 1.8mm - MEMs SMT Crystal 32.768 KHz 12.5pF 20ppm 4.9 x 1.8mm Crystal [Digikey: SE2415CT-ND] 8.0 x 3.8mm - Surface Mount Crystal 32.768kHz 12.5pF 20ppm -40°C-85°C [Digikey: 535-9166-2-ND] Cylinder 32.768KHz Cylinder Crystal (2x6mm body) [Ex. Digikey: 300-8341-2-ND]
Z1 = con-weidmueller-sl35:180-2: WEIDMUELLER CLAMP CONNECTOR; OC_FARNELL: unknown; OC_NEWARK: unknown